# Altium schematic sheet driver.SchDoc
size A4; SheetNumber: 2; SheetTotal: 3
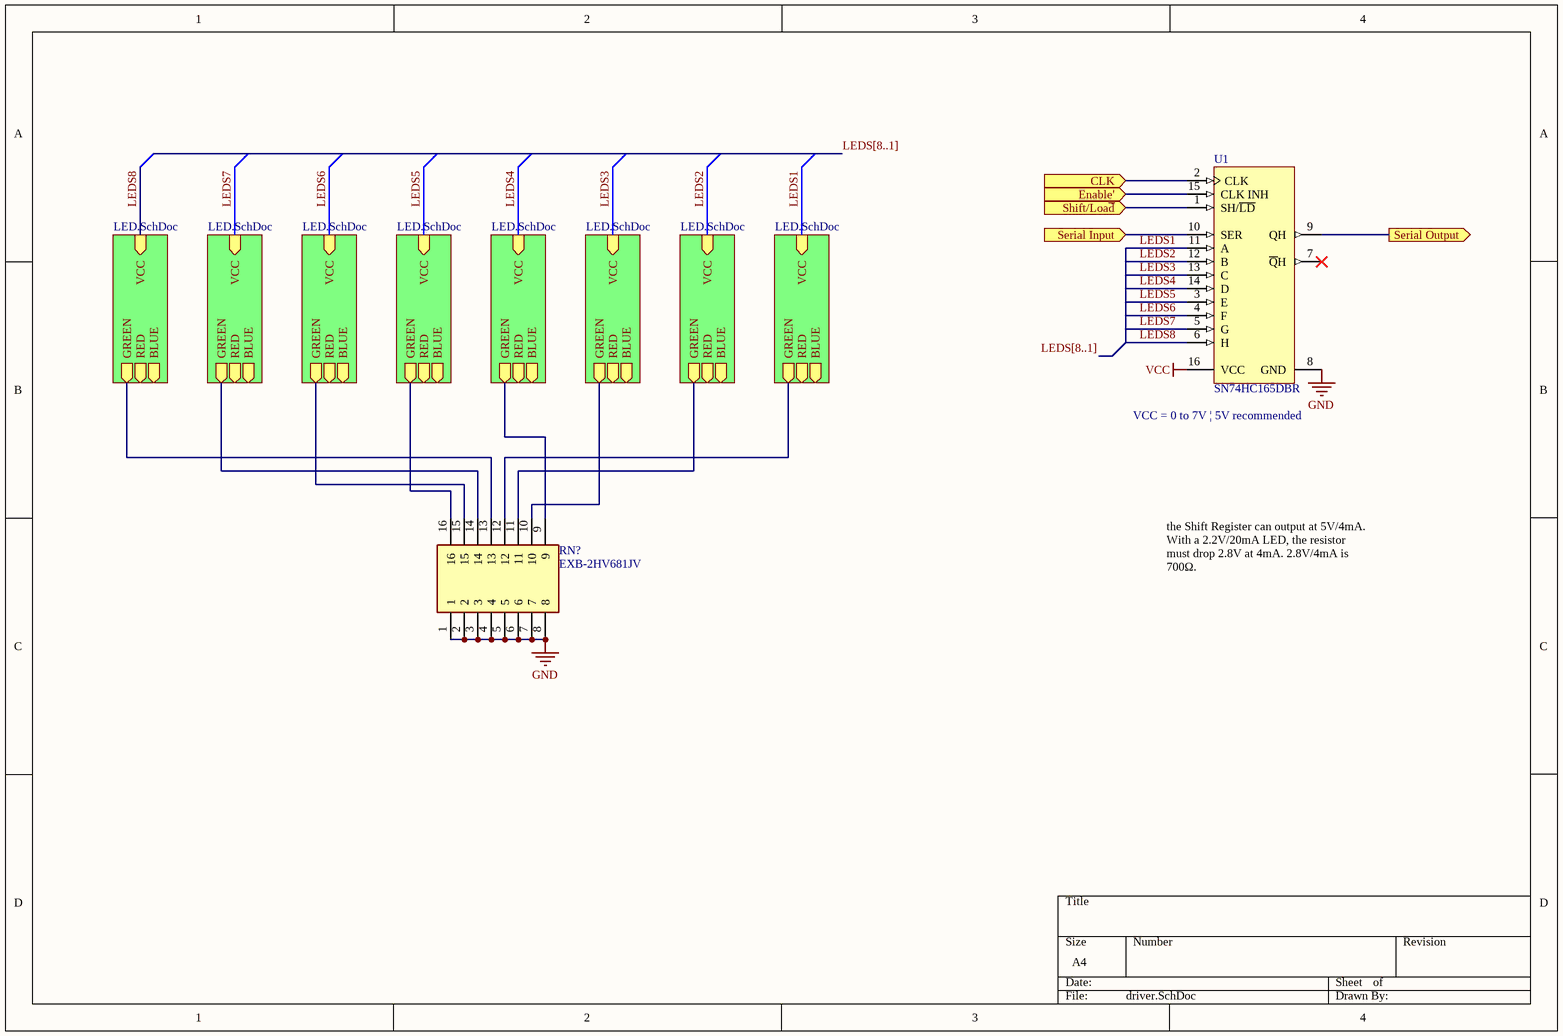
[diagram p0: driver.SchDoc]

## Parts
RN?  EXB-2HV681JV  [EXB2HV680JV]
U1  SN74HC165DBR  [DB0016A_N]

## Sub-sheets
Designator = LED.SchDoc: VCC (in), BLUE (out), RED (out), GREEN (out)
Designator = LED.SchDoc: VCC (in), BLUE (out), RED (out), GREEN (out)
Designator = LED.SchDoc: VCC (in), BLUE (out), RED (out), GREEN (out)
Designator = LED.SchDoc: VCC (in), BLUE (out), RED (out), GREEN (out)
Designator = LED.SchDoc: VCC (in), BLUE (out), RED (out), GREEN (out)
Designator = LED.SchDoc: VCC (in), BLUE (out), RED (out), GREEN (out)
Designator = LED.SchDoc: VCC (in), BLUE (out), RED (out), GREEN (out)
Designator = LED.SchDoc: VCC (in), BLUE (out), RED (out), GREEN (out)

## Ports
CLK (in), Enable' (in), Serial Input (in), Serial Output (out), Shift/Loa~{d} (in)

## Nets
GND: RN?.1 RN?.2 RN?.3 RN?.4 RN?.5 RN?.6 RN?.7 RN?.8 U1.8(GND)
VCC: U1.16(VCC)
CLK: U1.2(CLK) ; port CLK
Enable': U1.15(CLK_INH) ; port Enable'
LEDS1: U1.11(A) ; sheet Designator/VCC
LEDS2: U1.12(B) ; sheet Designator/VCC
LEDS3: U1.13(C) ; sheet Designator/VCC
LEDS4: U1.14(D) ; sheet Designator/VCC
LEDS5: U1.3(E) ; sheet Designator/VCC
LEDS6: U1.4(F) ; sheet Designator/VCC
LEDS7: U1.5(G) ; sheet Designator/VCC
LEDS8: U1.6(H) ; sheet Designator/VCC
Serial Input: U1.10(SER) ; port Serial Input
Serial Output: U1.9(QH) ; port Serial Output
Shift/Loa~{d}: U1.1(SH/~{LD}) ; port Shift/Loa~{d}
NetRN?_9: RN?.9 ; sheet Designator/GREEN
NetRN?_10: RN?.10 ; sheet Designator/GREEN
NetRN?_11: RN?.11 ; sheet Designator/GREEN
NetRN?_12: RN?.12 ; sheet Designator/GREEN
NetRN?_13: RN?.13 ; sheet Designator/GREEN
NetRN?_14: RN?.14 ; sheet Designator/GREEN
NetRN?_15: RN?.15 ; sheet Designator/GREEN
NetRN?_16: RN?.16 ; sheet Designator/GREEN

Not connected (* = marked no-connect by the designer): U1 7(~{Q}H)*

## Buses and harness runs
bus LEDS[8..1]

## Notes on the sheet
- (near U1) VCC = 0 to 7V | 5V recommended
- the Shift Register can output at 5V/4mA. With a 2.2V/20mA LED, the resistor must drop 2.8V at 4mA. 2.8V/4mA is 700Ω.

## Library data of the parts
RN? = EXB-2HV681JV: Resistor Network; Manufacturer_Name: Panasonic; Datasheet Link: https://industrial.panasonic.com/cdbs/www-data/pdf/AOC0000/AOC0000COL4.pdf; Height: 0.55mm; Manufacturer_Part_Number: EXB-2HV681JV; Mouser Part Number: 667-EXB-2HV681JV; Mouser Price/Stock: https://www.mouser.co.uk/ProductDetail/Panasonic/EXB-2HV681JV?qs=oE3VwAv%2FYtkCvpXzHWFIiQ%3D%3D; Arrow Part Number: EXB-2HV681JV; Arrow Price/Stock: https://www.arrow.com/en/products/exb-2hv681jv/panasonic
U1 = CMP-0780-00071-3: 8-Bit Parallel-Load Shift Registers, DB0016A, LARGE T&R; Manufacturer: Texas Instruments; Bits: 8; Input Type: CMOS; Rating: Catalog; Technology Family: HC; 3-State Output: No; Voltage(Nom)(V): 6; tpd @ Nom Voltage(Max)(ns): 38; ICC @ Nom Voltage(Max)(mA): 0.08; Output Drive (IOL/IOH)(Max)(mA): 5.2/-5.2; VCC(Min)(V): 2; F @ Nom Voltage(Max)(Mhz): 28; Code_JEDEC: MO-150; Operating Temperature Range(C): -40 to 125; DatasheetVersion: SCLS116G; PackageVersion: http://www.ti.com/lit/ml/mpds507/mpds507.pdf; PackageReference: DB0016A; Generic Part Number: SN74HC165; Output Type: CMOS; VCC(Max)(V): 6